# Altium schematic sheet [MP] Relay Control.SchDoc
size 254 x 208 mm; SheetNumber: 8; SheetTotal: 8
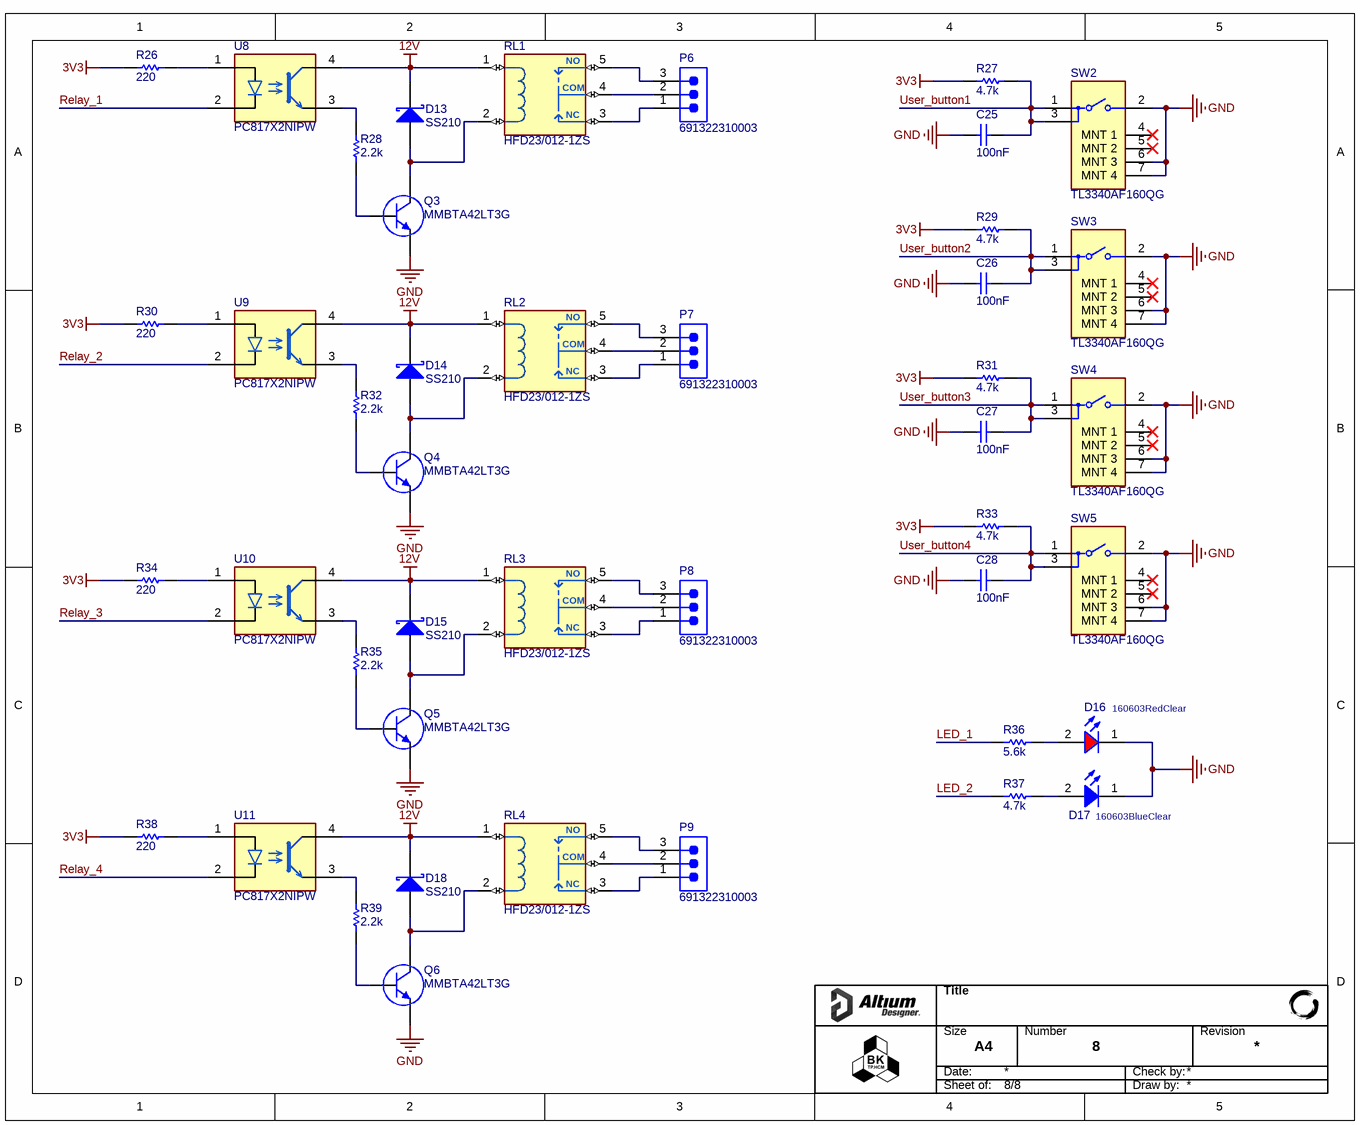
[diagram p0: [MP] Relay Control.SchDoc]

## Parts
C25  value 100nF  [CAP_0603]  (hidden comment: 0106031041050)
C26  value 100nF  [CAP_0603]  (hidden comment: 0106031041050)
C27  value 100nF  [CAP_0603]  (hidden comment: 0106031041050)
C28  value 100nF  [CAP_0603]  (hidden comment: 0106031041050)
D13  SS210  [SS210-Footprint-SMA]
D14  SS210  [SS210-Footprint-SMA]
D15  SS210  [SS210-Footprint-SMA]
D16  160603RedClear  [WL-SMCW_0603_H=0.7mm]
D17  160603BlueClear  [WL-SMCW_0603_H=0.7mm]
D18  SS210  [SS210-Footprint-SMA]
P6  691322310003  [691322310003]
P7  691322310003  [691322310003]
P8  691322310003  [691322310003]
P9  691322310003  [691322310003]
Q3  MMBTA42LT3G  [ONSC-SOT-23-3-318-08_V]
Q4  MMBTA42LT3G  [ONSC-SOT-23-3-318-08_V]
Q5  MMBTA42LT3G  [ONSC-SOT-23-3-318-08_V]
Q6  MMBTA42LT3G  [ONSC-SOT-23-3-318-08_V]
R26  value 220  [RES_0603]  (hidden comment: 0006032211)
R27  value 4.7k  [RES_0603]  (hidden comment: 0006034721)
R28  value 2.2k  [RES_0603]  (hidden comment: 0006032221)
R29  value 4.7k  [RES_0603]  (hidden comment: 0006034721)
R30  value 220  [RES_0603]  (hidden comment: 0006032211)
R31  value 4.7k  [RES_0603]  (hidden comment: 0006034721)
R32  value 2.2k  [RES_0603]  (hidden comment: 0006032221)
R33  value 4.7k  [RES_0603]  (hidden comment: 0006034721)
R34  value 220  [RES_0603]  (hidden comment: 0006032211)
R35  value 2.2k  [RES_0603]  (hidden comment: 0006032221)
R36  value 5.6k  [RES_0603]  (hidden comment: 0006035621)
R37  value 4.7k  [RES_0603]  (hidden comment: 0006034721)
R38  value 220  [RES_0603]  (hidden comment: 0006032211)
R39  value 2.2k  [RES_0603]  (hidden comment: 0006032221)
RL1  HFD23/012-1ZS  [HFD23_012-1ZS-Footprint-1]
RL2  HFD23/012-1ZS  [HFD23_012-1ZS-Footprint-1]
RL3  HFD23/012-1ZS  [HFD23_012-1ZS-Footprint-1]
RL4  HFD23/012-1ZS  [HFD23_012-1ZS-Footprint-1]
SW2  TL3340AF160QG  [FP-TL3340AF160QG-MFG]
SW3  TL3340AF160QG  [FP-TL3340AF160QG-MFG]
SW4  TL3340AF160QG  [FP-TL3340AF160QG-MFG]
SW5  TL3340AF160QG  [FP-TL3340AF160QG-MFG]
U8  PC817X2NIPW  [PC817X2NIPW-Footprint]
U9  PC817X2NIPW  [PC817X2NIPW-Footprint]
U10  PC817X2NIPW  [PC817X2NIPW-Footprint]
U11  PC817X2NIPW  [PC817X2NIPW-Footprint]

## Nets
3V3: R26.1 R27.1 R29.1 R30.1 R31.1 R33.1 R34.1 R38.1
12V: D13.2(K) D14.2(K) D15.2(K) D18.2(K) RL1.1(C1) RL2.1(C1) RL3.1(C1) RL4.1(C1) U8.4 U9.4 U10.4 U11.4
GND: C25.1 C26.1 C27.1 C28.1 D16.1(K) D17.1(K) Q3.2(E) Q4.2(E) Q5.2(E) Q6.2(E) SW2.2 SW2.6(MNT_3) SW2.7(MNT_4) SW3.2 SW3.6(MNT_3) SW3.7(MNT_4) SW4.2 SW4.6(MNT_3) SW4.7(MNT_4) SW5.2 SW5.6(MNT_3) SW5.7(MNT_4)
LED_1: R36.1
LED_2: R37.1
Relay_1: U8.2
Relay_2: U9.2
Relay_3: U10.2
Relay_4: U11.2
User_button1: C25.2 R27.2 SW2.1 SW2.3
User_button2: C26.2 R29.2 SW3.1 SW3.3
User_button3: C27.2 R31.2 SW4.1 SW4.3
User_button4: C28.2 R33.2 SW5.1 SW5.3
NetD13_1: D13.1(A) Q3.3(C) RL1.2(C2)
NetD14_1: D14.1(A) Q4.3(C) RL2.2(C2)
NetD15_1: D15.1(A) Q5.3(C) RL3.2(C2)
NetD16_2: D16.2(A) R36.2
NetD17_2: D17.2(A) R37.2
NetD18_1: D18.1(A) Q6.3(C) RL4.2(C2)
NetP6_1: P6.1 RL1.3(NO)
NetP6_2: P6.2 RL1.4(C)
NetP6_3: P6.3 RL1.5(C)
NetP7_1: P7.1 RL2.3(NO)
NetP7_2: P7.2 RL2.4(C)
NetP7_3: P7.3 RL2.5(C)
NetP8_1: P8.1 RL3.3(NO)
NetP8_2: P8.2 RL3.4(C)
NetP8_3: P8.3 RL3.5(C)
NetP9_1: P9.1 RL4.3(NO)
NetP9_2: P9.2 RL4.4(C)
NetP9_3: P9.3 RL4.5(C)
NetQ3_1: Q3.1(B) R28.1
NetQ4_1: Q4.1(B) R32.1
NetQ5_1: Q5.1(B) R35.1
NetQ6_1: Q6.1(B) R39.1
NetR26_2: R26.2 U8.1
NetR28_2: R28.2 U8.3
NetR30_2: R30.2 U9.1
NetR32_2: R32.2 U9.3
NetR34_2: R34.2 U10.1
NetR35_2: R35.2 U10.3
NetR38_2: R38.2 U11.1
NetR39_2: R39.2 U11.3

Not connected (* = marked no-connect by the designer): SW2 4(MNT_1)* 5(MNT_2)*; SW3 4(MNT_1)* 5(MNT_2)*; SW4 4(MNT_1)* 5(MNT_2)*; SW5 4(MNT_1)* 5(MNT_2)*

## Notes on the sheet
- Title
- Size
- Date:
- A4
- Number
- Check by:
- Revision
- Sheet of:
- Draw by:
- (in symbol CMP-008-00006-2) COM; NC

## Library data of the parts
C25-C28 = CMP-001-00176-3: CAP, size 0603, 100 nF, 50 VDC, 10%; Manufacturer: TDK; Manufacturer Part Number: CGA3E3X8R1H104K080AE; Voltage Rating DC: 50 VDC; Supplier 1 Part Number: 810-CGA3E3X8R1H104KA; Supplier 1 URL: https://www.mouser.com/ProductDetail/TDK/CGA3E3X8R1H104K080AE?qs=nQSIdc08i%252Bd8g3IRRgU2bw%3D%3D&utm_source=mouser-refine-download&utm_medium=file&utm_campaign=CGA3E3X8R1H104K080AE&utm_content=TDK; Tolerance: 10%; Pins: 2; Case/Package: 0603; LCSC Part #: C14663; ComponentLink1Description: Datasheet; Packaging: Tape and Reel; Supplier 3 URL: https://www.thegioiic.com/tu-gom-0603-100nf-0-1uf-50v; Design Item ID: 0106031041050; Mount: SMD/SMT; Operating Temperature Min: - 40 C; ComponentLink1URL: https://product.tdk.com/system/files/dam/doc/product/capacitor/ceramic/mlcc/catalog/mlcc_automotive_soft_en.pdf?ref_disty=mouser; Supplier 2 URL: https://www.digikey.com/en/products/detail/tdk-corporation/cga3e3x8r1h104k080ae/5809262; Supplier 2 Part Number: 445-173697-2-ND; Operating Temperature Max: + 85 C; Supplier 3 Part Number: N/A; Component Type: Standard; Source: Capacitor_0603_10_percent.SchLib
D13-D15 D18 = CMP-004-00056-1: Rectifier Diode, Schottky, 1 Phase, 1 Element, 1.5A, 100V V(RRM), Silicon, DO-214AA; Forward Voltage: 430mV; Max Operating Temperature: 150°C; Min Operating Temperature: -55°C; RoHS Compliant: Yes; Pins: 2
D16 = CMP-004-00038-2: WL-SMCW SMT Mono-color Chip LED Waterclear, size 0603, Red, 2V, 140deg; Value: Red, 2V; Type: Clear; ComponentLink1Description: Datasheet link; ComponentLink2Description: Supplier 1 URL; Supplier 3 SN: N/A; Design Item ID: 160603RedClear; Source: WL-SMCW_0603.SchLib; Supplier 3 Name: ICDayRoi; Size: 0603; Supplier 1 SN: 710-150060RS75000; Pins: 2; ComponentLink4Description: Supplier 3 URL; Component Type: Standard; ComponentLink2URL: https://www.mouser.vn/ProductDetail/Wurth-Elektronik/150060RS75000?qs=LlUlMxKIyB3QnmZ3fw%2FVCA%3D%3D; Color: Red; ComponentLink3Description: Supplier 2 URL; Supplier 3 URL: https://www.thegioiic.com/led-do-0603-dan-smd-trong-suot; Supplier 2 URL: https://www.digikey.com/en/products/detail/liteon/LTST-C191KRKT/386837; ComponentLink1URL: N/A; ComponentLink3URL: https://www.digikey.com/en/products/detail/liteon/LTST-C191KRKT/386837; ComponentLink4URL: https://www.thegioiic.com/led-do-0603-dan-smd-trong-suot; Supplier 2 Name: Digi-Key; Supplier 1 Name: Mouser; Supplier 1 URL: https://www.mouser.vn/ProductDetail/Wurth-Elektronik/150060RS75000?qs=LlUlMxKIyB3QnmZ3fw%2FVCA%3D%3D; Supplier 2 SN: 160-1447-2-ND
D17 = CMP-004-00032-2: WL-SMCW SMT Mono-color Chip LED Waterclear, size 0603, Blue, 3.2V, 140deg; Type: Clear; Supplier 2 SN: 160-1647-2-ND; ComponentLink1URL: N/A; ComponentLink2URL: https://www.mouser.vn/ProductDetail/Wurth-Elektronik/150060BS75003?qs=Li%252BoUPsLEnu8LvIbM48DKA%3D%3D; Supplier 3 SN: N/A; Supplier 1 Name: Mouser; ComponentLink1Description: Datasheet link; Supplier 1 URL: https://www.mouser.vn/ProductDetail/Wurth-Elektronik/150060BS75003?qs=Li%252BoUPsLEnu8LvIbM48DKA%3D%3D; Size: 0603; Supplier 1 SN: 710-150060GS75000; Source: WL-SMCW_0603.SchLib; ComponentLink3URL: https://www.digikey.com/en/products/detail/liteon/LTST-C191TBKT/388530; Design Item ID: 160603BlueClear; Value: Blue, 3.2V; ComponentLink2Description: Supplier 1 URL; ComponentLink4URL: https://www.thegioiic.com/led-xanh-duong-0603-dan-smd-trong-suot; ComponentLink4Description: Supplier 3 URL; Supplier 2 URL: https://www.digikey.com/en/products/detail/liteon/LTST-C191TBKT/388530; Supplier 2 Name: Digi-Key; Supplier 3 Name: ICDayRoi; Supplier 3 URL: https://www.thegioiic.com/led-xanh-duong-0603-dan-smd-trong-suot; Pins: 2; ComponentLink3Description: Supplier 2 URL; Color: Blue; Component Type: Standard
P6-P9 = CMP-002-00338-1: WR-TBL Series 322 Horizontal PCB Header, THT, pitch 3.81mm, 3p; Manufacturer: Wurth Elektronik; Modularity: No; Working Voltage: 300V; Rated Current: 10A; Value: 10A, 300V; Supplier 3 Part Number: N/A; Mount: Through Hole; Operating Temperature Max: 105°C; Operating Temperature Min: -40°C; Category: Terminal Blocks; Supplier 1 URL: N/A; Design Item ID: 691322310003; ComponentLink1URL: https://www.we-online.com/redexpert/spec/691322310003?ad; Number of Rows: 1; Supplier 3 URL: https://www.thegioiic.com/ul-3-81-3-r-terminal-block-plug-in-han-pcb-3-chan-cong-3-81mm-300v-10a-ulo; Component Type: Standard; Manufacturer Part Number: 691322310003; Orientation: Horizontal; Pin Count: 3; Pitch: 3.81mm; Source: Terminal_Blocks_Pluggable_3.81mm.SchLib; ComponentLink1Description: Datasheet; Supplier 2 URL: N/A; Supplier 1 Part Number: N/A; Supplier 2 Part Number: N/A; Pins: 3; Packaging: Box; Match Code: WR-TBL; Application: Pluggable
Q3-Q6 = CMP-013-00034-2: Small Signal Bipolar Transistor, 0.5A I(C), 300V V(BR)CEO, 1-Element, NPN, Silicon, TO-236AB; Frequency: 50MHz; RoHS Compliant: Yes; Pins: 3; Max Operating Temperature: 150°C
R26 R30 R34 R38 = CMP-009-00275-5: RES, size 0603, 220 Ohm, 1/10 W, 1%; Manufacturer: YAGEO; Manufacturer Part Number: RC0603FR-07220RL; Rated Power: 1/10 W; Supplier 2 URL: N/A; Case/Package: 0603; Supplier 3 Part Number: N/A; Mount: SMD/SMT; Tolerance: 1%; Design Item ID: 0006032211; Supplier 1 Part Number: 603-RC0603FR-07220RL; Pins: 2; Component Type: Standard; Operating Temperature Min: - 40 C; Supplier 1 URL: https://www.mouser.vn/ProductDetail/YAGEO/RC0603FR-07220RL?qs=VU8sRB4EgwA1IyQ0vhXEEw%3D%3D; Packaging: Tape and Reel; Operating Temperature Max: + 85 C; Source: Resistor_0603.SchLib; Supplier 2 Part Number: N/A; ComponentLink1Description: Datasheet; LCSC Part #: C107696; ComponentLink1URL: https://www.mouser.vn/datasheet/2/447/YAGEO_PYu_RC_Group_51_RoHS_L_12-3313492.pdf; Supplier 3 URL: N/A
R27 R29 R31 R33 R37 = CMP-009-00346-5: RES, size 0603, 4.7 kOhm, 1/10 W, 1%; Manufacturer: YAGEO; Manufacturer Part Number: RC0603FR-074K7L; Rated Power: 1/10 W; LCSC Part #: C99782; Component Type: Standard; Supplier 2 Part Number: N/A; Supplier 2 URL: N/A; Supplier 1 Part Number: 603-RC0603FR-074K7L; Supplier 1 URL: https://www.mouser.vn/ProductDetail/YAGEO/RC0603FR-074K7L?qs=gt6vzsuosg37y0l7Vt36bQ%3D%3D; Source: Resistor_0603.SchLib; Packaging: Tape and Reel; Supplier 3 URL: N/A; Supplier 3 Part Number: N/A; Tolerance: 1%; Operating Temperature Min: - 40 C; ComponentLink1Description: Datasheet; Mount: SMD/SMT; Design Item ID: 0006034721; ComponentLink1URL: https://www.mouser.vn/datasheet/2/447/YAGEO_PYu_RC_Group_51_RoHS_L_12-3313492.pdf; Operating Temperature Max: + 85 C; Case/Package: 0603; Pins: 2
R28 R32 R35 R39 = CMP-009-00277-5: RES, size 0603, 2.2  KOhm, 1/10 W, 1%; Manufacturer Part Number: OEM; Rated Power: 1/10 W; Supplier 2 Part Number: 13-RC0603FR-132K2LTR-ND; Operating Temperature Max: + 85 C; Tolerance: 1%; Mount: SMD/SMT; LCSC Part #: N/A; Supplier 1 Part Number: 603-SR0603FR-7T2K2L; Supplier 1 URL: https://www.mouser.vn/ProductDetail/YAGEO/SR0603FR-7T2K2L?qs=pfd5qewlna6SQQIuviAJZA%3D%3D; Supplier 3 Part Number: N/A; Pins: 2; Supplier 3 URL: N/A; Supplier 2 URL: https://www.digikey.com/en/products/detail/yageo/RC0603FR-132K2L/13694214; ComponentLink1Description: Datasheet; Manufacturer: OEM; Case/Package: 0603; Packaging: Tape and Reel; Component Type: Standard; ComponentLink1URL: N/A; Source: Resistor_0603.SchLib; Operating Temperature Min: - 40 C; Design Item ID: 0006032221
R36 = CMP-009-00362-5: RES, size 0603, 5.6 KOhm, 1/10 W, 1%; Manufacturer Part Number: OEM; Rated Power: 1/10 W; Operating Temperature Max: + 85 C; Design Item ID: 0006035621; Pins: 2; Supplier 1 Part Number: 667-ERJ-UP3F5601V; ComponentLink1Description: Datasheet; Case/Package: 0603; Supplier 3 URL: N/A; Supplier 3 Part Number: N/A; Source: Resistor_0603.SchLib; Packaging: Tape and Reel; Supplier 1 URL: https://www.mouser.vn/ProductDetail/Panasonic/ERJ-UP3F5601V?qs=sGAEpiMZZMvdGkrng054twq3eZrCFN89ezYxgAsnxBTZYD17cS%252B65A%3D%3D; Manufacturer: OEM; Supplier 2 Part Number: 10-ERJ-UP3F5601VTR-ND 10-ERJ-UP3F5601VCT-ND 10-ERJ-UP3F5601VDKR-ND; Component Type: Standard; Supplier 2 URL: https://www.digikey.com/en/products/detail/panasonic-electronic-components/ERJ-UP3F5601V/12092890; Mount: SMD/SMT; Tolerance: 1%; LCSC Part #: N/A; Operating Temperature Min: - 40 C; ComponentLink1URL: https://api.pim.na.industrial.panasonic.com/file_stream/main/fileversion/4484
RL1-RL4 = CMP-008-00006-2: Power/Signal Relay, 1 Form C, SPDT, Momentary, 0.0125A (Coil), 18VDC (Coil), 150mW (Coil), 2A (Contact), 60VDC (Contact), DC Input, AC/DC Output, Through Hole-Straight Mount; Contact AC Max Rating R Load: 2A@125VAC; Operate Time: 5ms; Coil Voltage(DC)-Max: 12V; Reference Standard: UL; Contact Voltage(DC)-Max: 60V; Coil Operate Voltage(DC): 9.6V; Coil Resistance: 960R; Electrical Life: 90000Cycles; Body Height: 10mm; Coil Release Voltage(DC): 1.2V; Contact DC Max Rating R Load: 2A@60VDC; Body Breadth: 7.5inch; Coil Current(DC)-Max: 13mA; Body Length or Diameter: 12.5mm; Contact Voltage(AC)-Max: 125V; Mounting Technology: Through Hole; Max Operating Temperature: 70°C; Coil/Input Supply Type: DC; Contact Current(DC)-Max: 2A; Relay Action: MOMENTARY; Min Operating Temperature: -40°C; Coil Power: 150mW; RoHS Compliant: Yes; Contact/Output Supply Type: AC/DC; Reach SVHC Compliant: Yes; Relay Function: SPDT; Contact Current(AC)-Max: 2A; Release Time: 5ms; Termination: Solder; Relay Type: POWER/SIGNAL RELAY
SW2-SW5 = CMP-011-00022-2: Keypad Switch, 1 Switches, SPST, Momentary-tactile, 0.05A, 12VDC, 2.06N, Solder Terminal, Surface Mount-right Angle; Manufacturer Series: TL3340; Body Breadth: 3.4inch; Contact Current(DC)-Max: 50mA; Circuit Configuration: 1X1; Body Length or Diameter: 4.49mm; Contact DC Max Rating R Load: .05A@12VDC; Contact Voltage(DC)-Max: 12V; Number of Switches: 1; Body Height: 3.3mm; Electrical Life: 100000Cycles; Switch Function: SPST; Switch Action: MOMENTARY-TACTILE; Reach SVHC Compliant: Yes; JESD-609 Code: e4; Min Operating Temperature: -35°C; Termination: Solder; Terminal Finish: Silver; Operating Force-Max: 2.06N; Switch Type: Keypad; Max Operating Temperature: 85°C; Mounting Technology: Surface Mount; RoHS Compliant: Yes
U8-U11 = CMP-00026-00001-2: PC817 series, SMD, I_F (max) = 500mA, V_F (max) = 1.4V.